# EAGLE design Encoder (EAGLE 6.2)
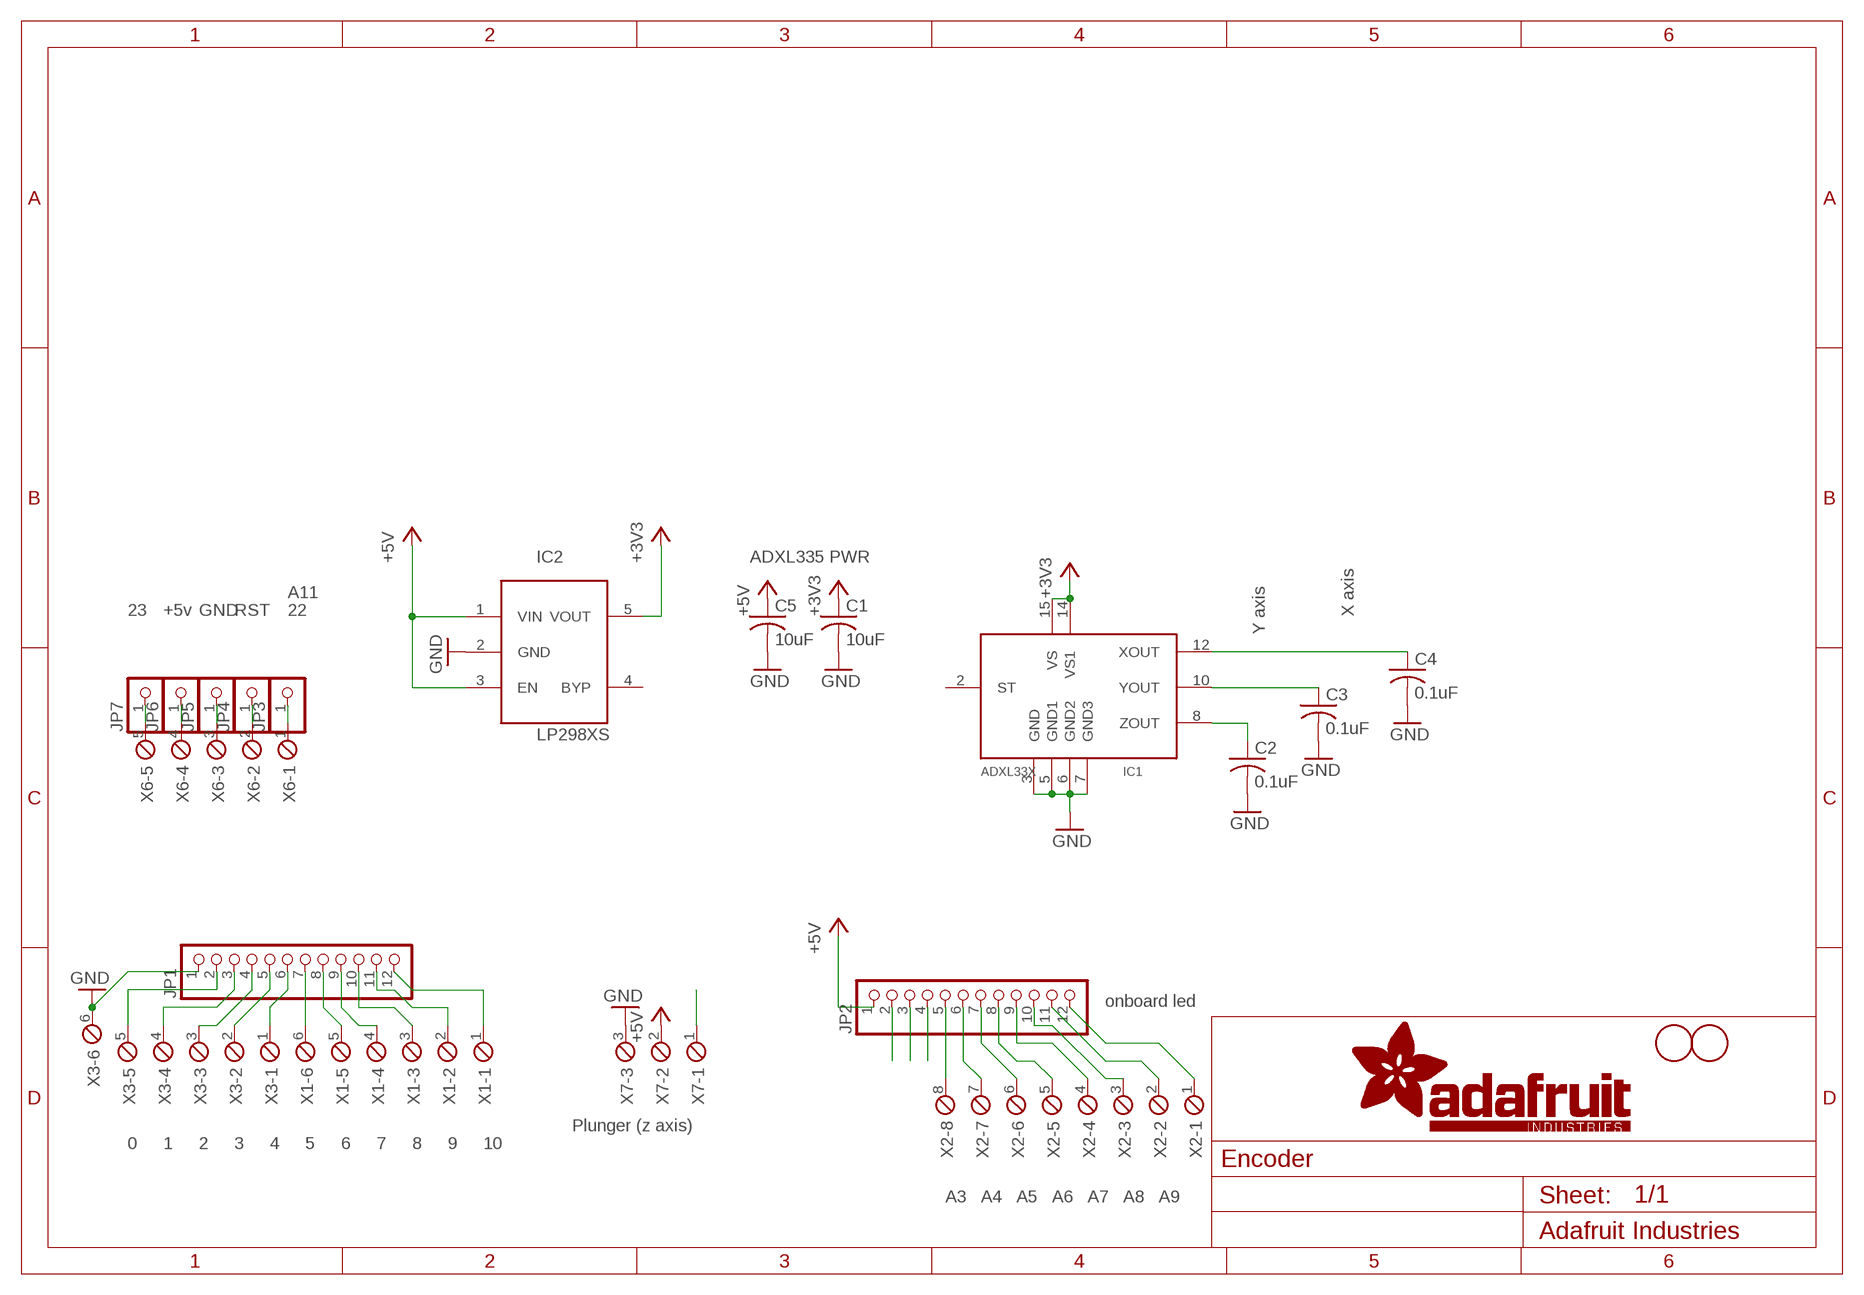
[diagram p0: schematic, sheet 1]

## Parts
C1  10uF  C-USC0805K  [C0805K]
C2  0.1uF  C-USC0805K  [C0805K]
C3  0.1uF  C-USC0805K  [C0805K]
C4  0.1uF  C-USC0805K  [C0805K]
C5  10uF  C-USC0805K  [C0805K]
IC1  ADXL33X  [16LCSP]
IC2  LP298XS  [SOT23-5L]
JP1  PINHD-1X12-CB  [1X12-CB]
JP2  PINHD-1X12-CB  [1X12-CB]
JP3  PINHD-1X1CB  [1X01-CLEANBIG]
JP4  PINHD-1X1CB  [1X01-CLEANBIG]
JP5  PINHD-1X1CB  [1X01-CLEANBIG]
JP6  PINHD-1X1CB  [1X01-CLEANBIG]
JP7  PINHD-1X1CB  [1X01-CLEANBIG]
U$1  FIDUCIAL  [FIDUCIAL_1MM]
U$2  FIDUCIAL  [FIDUCIAL_1MM]
X1  MPT6  [6POL254]
X2  MPT8  [8POL254]
X3  MPT6  [6POL254]
X6  MPT5  [5POL254]
X7  MPT3  [3POL254]

## Nets
+3V3: C1.1 IC1.14(VS1) IC1.15(VS) IC2.5(VOUT)
+5V: C5.1 IC2.1(VIN) IC2.3(EN) JP2.1 X7.2
GND: C1.2 C2.2 C3.2 C4.2 C5.2 IC1.3(GND) IC1.5(GND1) IC1.6(GND2) IC1.7(GND3) IC2.2(GND) JP1.1 X3.6 X7.3
N$1: JP2.5 X2.8
N$2: JP2.6 X2.7
N$3: JP2.7 X2.6
N$4: JP2.8 X2.5
N$5: JP2.9 X2.4
N$6: JP2.10 X2.3
N$7: JP2.11 X2.2
N$8: JP7.1 X6.5
N$9: JP6.1 X6.4
N$10: JP5.1 X6.3
N$11: JP4.1 X6.2
N$12: JP3.1 X6.1
N$13: JP1.2 X3.5
N$14: JP1.3 X3.4
N$15: JP1.4 X3.3
N$16: JP1.5 X3.2
N$17: JP1.6 X3.1
N$18: JP1.7 X1.6
N$19: JP1.8 X1.5
N$20: JP1.9 X1.4
N$21: JP1.10 X1.3
N$22: JP1.11 X1.2
N$23: JP1.12 X1.1
N$24: JP2.12 X2.1
XOUT: C4.1 IC1.12(XOUT) JP2.2
YOUT: C3.1 IC1.10(YOUT) JP2.3
ZIN: JP2.4 X7.1
ZOUT: C2.1 IC1.8(ZOUT)
Unconnected: IC1.2(ST) IC2.4(BYP)

## Notes on the sheet
- ADXL335 PWR
- A11
- 23 | +5v | GND | RST | 22 | X axis
- Y axis
- onboard led
- Plunger (z axis)
- 0 | 1 | 2 | 3 | 4 | 5 | 6 | 7 | 8 | 9 | 10
- A3 | A4 | A5 | A6 | A7 | A8 | A9

## Library data of the parts
C1-C5 = adafruit:C-US: CAPACITOR, American symbol
IC1 = adafruit:ADXL33X
IC2 = adafruit:LP298X
JP1 JP2 = adafruit:PINHD-1X12: PIN HEADER
JP3-JP7 = adafruit:PINHD-1X1: Pin header 1x1 for 0.1" spacing With round pins
U$1 U$2 = adafruit:FIDUCIAL: For use by pick and place machines to calibrate the vision/machine, 1mm By microbuilder.eu
X1 X3 = con-phoenix-254:MPT6: PHOENIX CONNECTOR; OC_FARNELL: unknown; OC_NEWARK: unknown
X2 = con-phoenix-254:MPT8: PHOENIX CONNECTOR; OC_FARNELL: unknown; OC_NEWARK: unknown
X6 = con-phoenix-254:MPT5: PHOENIX CONNECTOR; OC_FARNELL: unknown; OC_NEWARK: unknown
X7 = con-phoenix-254:MPT3: PHOENIX CONNECTOR; OC_FARNELL: unknown; OC_NEWARK: unknown

## Net classes
0 default: width 0.152 mm, clearance 0.203 mm

## Board
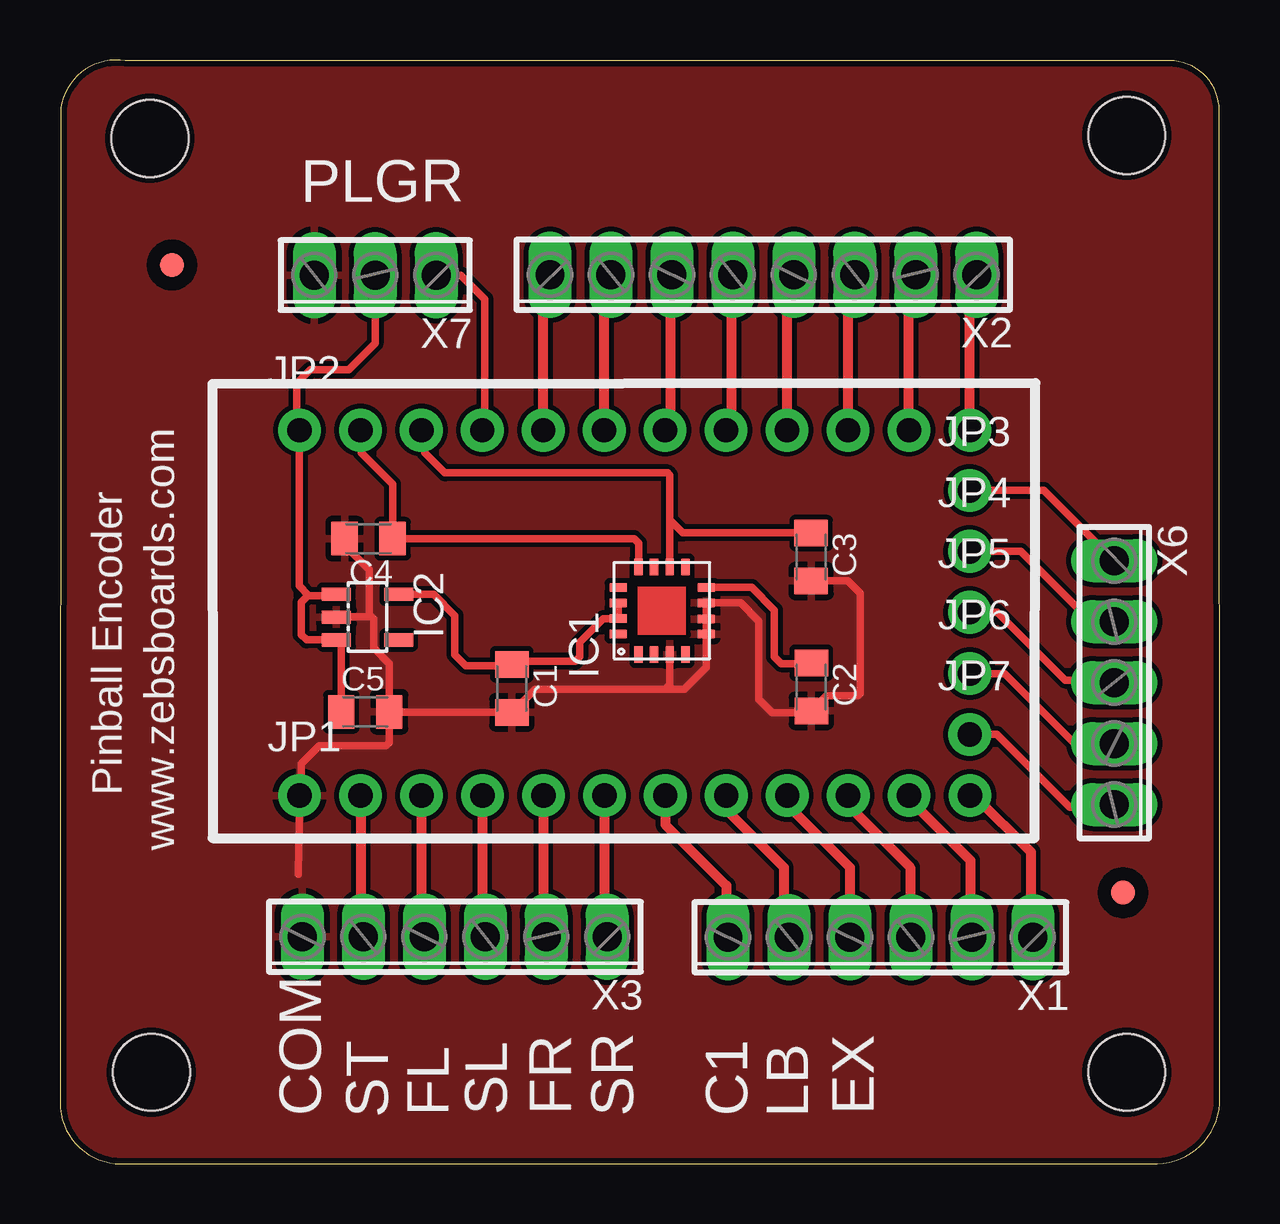
[diagram p1: board, top side]
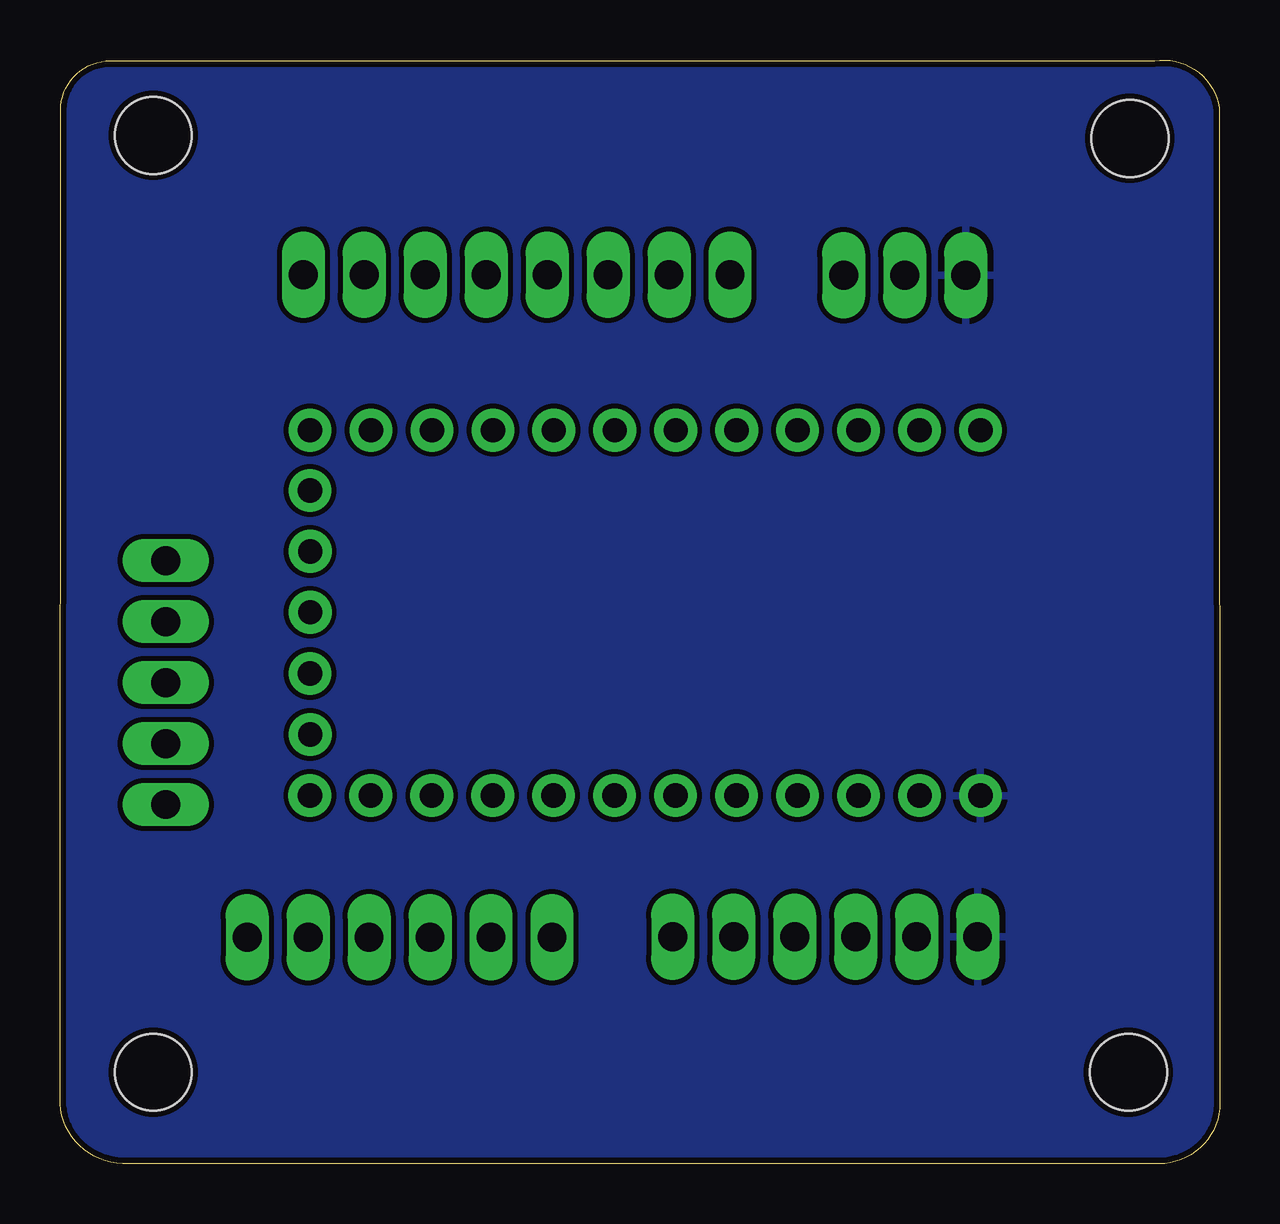
[diagram p2: board, bottom side, seen from below]

Size 48.33 x 45.99 mm. Coordinates in mm from the lower left corner, seen from the top.
Outline: 0,2.54 arc90 2.54,0 45.72,0 arc90 48.33,2.75 48.3,43.89 arc90 46.23,45.96 2.73,45.96 arc90 0.03,44.01 0,2.54
Copper layers (1*16): Top 0.035mm / dielectric 1.5mm / Bottom 0.035mm
Design rules: minimum track width 6mil, minimum drill 12mil, track to track 6mil, track to pad 6mil, pad to pad 6mil, via to via 6mil, smd to smd 0mil, copper to edge 10mil, drill to drill 10mil, minimum pad ring 10mil, minimum via ring 6mil, stop-mask expansion 2mil, vias tented up to drill 100mil, thermal gap 10mil
Holes 3.2 mm at 3.75,42.72 3.81,3.81 44.45,42.85 44.45,3.81

### Footprints (pad centres in the part's own frame; a part is rotated, then mirrored left to right if it is on the bottom)
C0805K = smd 1.1 x 1.4: 1 -1,0; 2 1,0
16LCSP = smd 0.7 x 0.35: 1 -1.825,0.975; 2 -1.825,0.325; 3 -1.825,-0.325; 4 -1.825,-0.975; 9 1.825,-0.975; 10 1.825,-0.325; 11 1.825,0.325; 12 1.825,0.975 | smd 0.35 x 0.7: 5 -0.975,-1.85; 6 -0.35,-1.85; 7 0.325,-1.85; 8 0.975,-1.85; 13 0.975,1.825; 14 0.325,1.825; 15 -0.325,1.825; 16 -0.975,1.825
SOT23-5L = smd 0.55 x 1.2: 1 -0.95,-1.3; 2 0,-1.3; 3 0.95,-1.3; 4 0.95,1.3; 5 -0.95,1.3
1X12-CB = drill 1.016 pad 1.778: 1 -13.97,0; 2 -11.43,0; 3 -8.89,0; 4 -6.35,0; 5 -3.81,0; 6 -1.27,0; 7 1.27,0; 8 3.81,0; 9 6.35,0; 10 8.89,0; 11 11.43,0; 12 13.97,0
1X01-CLEANBIG = drill 1.016 pad 1.778: 1 0,0
FIDUCIAL_1MM = smd 1 x 1: 1 0,0
6POL254 = drill 1.2 pad 1.778 long: 1 -6.35,0; 2 -3.81,0; 3 -1.27,0; 4 1.27,0; 5 3.81,0; 6 6.35,0
8POL254 = drill 1.2 long: 1 -8.89,0; 2 -6.35,0; 3 -3.81,0; 4 -1.27,0; 5 1.27,0; 6 3.81,0; 7 6.35,0; 8 8.89,0
5POL254 = drill 1.2 long: 1 -5.08,0; 2 -2.54,0; 3 0,0; 4 2.54,0; 5 5.08,0
3POL254 = drill 1.2 long: 1 -2.54,0; 2 0,0; 3 2.54,0

### Placement (x,y rotation side)
C1  18.83,19.81 270 top
C2  31.31,19.87 270 top
C3  31.3,25.29 270 top
C4  12.86,26.05 180 top
C5  12.72,18.83 0 top
IC1  25.08,23.04 90 top
IC2  12.81,22.78 270 top
JP1  23.95,15.35 0 top
JP2  23.94,30.57 0 top
JP3  37.91,28.06 0 top
JP4  37.9,25.52 0 top
JP5  37.9,22.98 0 top
JP6  37.91,20.43 0 top
JP7  37.9,17.89 0 top
U$1  44.29,11.3 0 top
U$2  4.66,37.45 0 top
X1  34.18,9.44 180 top
X2  29.3,37.05 180 top
X3  16.45,9.46 180 top
X6  43.93,20.05 270 top
X7  13.13,37.03 180 top

### Tracks (layer width: path | path; a pad name or v marks a point on that pad's centre or on a via)
+3V3
  Top 0.305: IC1.14 IC1.15 22.64,22.72 21.65,21.73 21.65,21.12 21.46,20.94 18.96,20.94 C1.1 18.77,20.75 16.92,20.75 16.45,21.22 16.45,22.84 15.57,23.73 IC2.5
+5V
  Top 0.305: C5.1 11.72,21.63 IC2.3 10.27,21.83 10.05,22.05 10.05,23.4 10.33,23.68 10.37,23.68 | 10.37,23.68 11.46,23.68 IC2.1 | 10.37,23.68 9.97,24.08 JP2.1 9.87,30.67 9.87,32.52 10.43,33.08 12.03,33.08 13.13,34.18 X7.2
GND
  Top 0.305: 9.92,12.06 JP1.1 10.05,15.41 10.05,16.67 10.79,17.41 13.58,17.41 13.72,17.55 C5.2 | C3.2 32.83,24.29 33.34,23.77 33.34,19.59 33.25,19.5 31.93,19.5 C2.2 31.23,18.8 29.68,18.8 29.12,19.36 29.12,22.61 28.36,23.37 IC1.7 IC1.6 IC1.5 26.93,20.7 26.01,19.78 25.22,19.78 | 25.22,19.78 19.8,19.78 C1.2 13.74,18.81 C5.2 | IC1.3 25.41,19.96 25.22,19.78 | C5.2 13.72,20.84 13.06,21.5 13.06,22.7 12.97,22.8 | 12.97,22.8 11.53,22.8 IC2.2 | C4.2 11.86,25.77 12.88,24.75 12.88,22.89 12.97,22.8
  pour Top: -0.72,46.49 49.4,46.49 49.4,-0.64 -0.72,-0.64
  pour Bottom: -0.8,46.5 49.56,46.5 49.56,-0.64 -0.8,-0.64
N$1
  Top 0.406: JP2.5 20.14,36.77 X2.8
N$2
  Top 0.406: JP2.6 22.68,36.77 X2.7
N$3
  Top 0.305: 25.45,30.81 JP2.7
  Top 0.406: 25.45,30.81 25.45,37.01 X2.6
N$4
  Top 0.305: 27.99,30.81 JP2.8
  Top 0.406: 27.99,30.81 27.99,37.01 X2.5
N$5
  Top 0.406: JP2.9 30.3,36.77 X2.4
N$6
  Top 0.406: JP2.10 32.84,36.77 X2.3
N$7
  Top 0.406: JP2.11 35.38,36.77 X2.2
N$8
  Top 0.305: JP7.1 39.03,17.89 42.07,14.86 43.81,14.86 X6.5
N$9
  Top 0.305: JP6.1 39.37,20.43 42.44,17.36 43.78,17.36 X6.4
N$10
  Top 0.305: JP5.1 39.05,22.98 41.88,20.15 43.83,20.15 X6.3
N$11
  Top 0.305: JP4.1 40.04,25.52 42.81,22.75 43.77,22.75 X6.2
N$12
  Top 0.305: JP3.1 40.99,28.06 X6.1
N$13
  Top 0.406: JP1.2 12.52,9.58
  Top 0.61: 12.52,9.58 X3.5
N$14
  Top 0.406: JP1.3 15.06,9.58
  Top 0.61: 15.06,9.58 X3.4
N$15
  Top 0.406: JP1.4 17.6,9.58
  Top 0.61: 17.6,9.58 X3.3
N$16
  Top 0.406: JP1.5 20.14,9.58
  Top 0.61: 20.14,9.58 X3.2
N$17
  Top 0.406: JP1.6 22.68,9.58
  Top 0.61: 22.68,9.58 X3.1
N$18
  Top 0.406: JP1.7 25.22,14.13 27.77,11.59 27.77,9.51 X1.6
N$19
  Top 0.406: JP1.8 27.76,14.75 30.16,12.35 30.16,9.65 X1.5
N$20
  Top 0.406: JP1.9 30.3,14.96 32.91,12.35 X1.4
N$21
  Top 0.406: JP1.10 32.84,14.93 35.42,12.35 35.42,9.47
  Top 0.61: 35.42,9.47 X1.3
N$22
  Top 0.406: 35.38,15.2 37.94,12.64 37.94,9.49 X1.2
  Top 0.61: JP1.11 35.38,15.2
N$23
  Top 0.406: 38.1,15.35 40.45,12.99 40.45,9.52 X1.1
  Top 0.61: JP1.12 38.1,15.35
N$24
  Top 0.406: JP2.12 37.91,36.77 X2.1
XOUT
  Top 0.305: IC1.12 24.11,25.86 23.92,26.05 C4.1 13.86,28.32 12.55,29.62 12.55,30.53 JP2.2
YOUT
  Top 0.305: IC1.10 25.41,26.84 | 25.41,26.84 25.41,28.69 25.32,28.79 16.04,28.79 15.2,29.62 15.2,30.42 JP2.3 | C3.1 25.96,26.29 25.41,26.84
ZIN
  Top 0.305: X7.1 16.71,37.03 17.7,36.03 17.7,30.68 JP2.4
ZOUT
  Top 0.305: IC1.8 28.82,24.02 29.77,23.07 29.77,21.12 30.05,20.85 31.28,20.85 C2.1

### Text on the board
tPlace: Pinball Encoder | www.zebsboards.com
_tsilk: PLGR | COM | ST | FL | SL | FR | SR | C1 | LB | EX